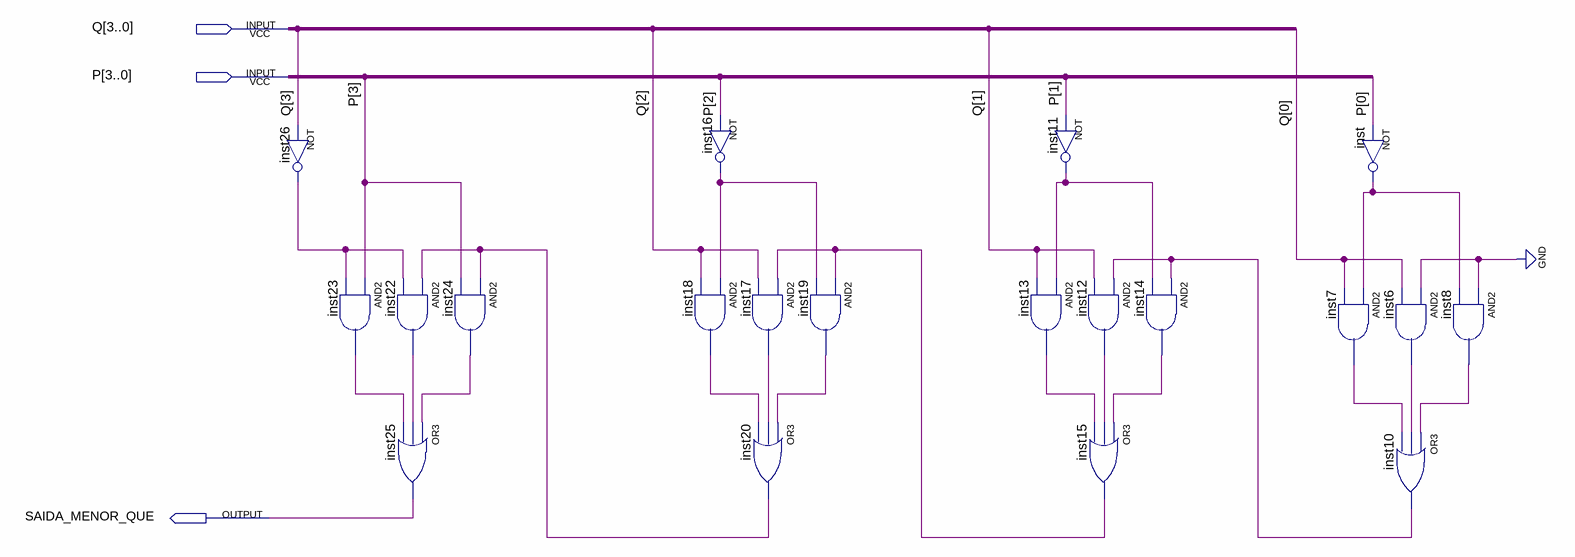
[diagram p0: schematic sheet]
// Quartus schematic MENOR_QUE4bt.bdf as structural Verilog: 20 symbols, 3 pins
module MENOR_QUE4bt (
  input  [3:0] Q,
  input  [3:0] P,
  output SAIDA_MENOR_QUE
);

  wire inst6_out, inst7_out, inst8_out, inst10_out, inst11_out, inst12_out, inst13_out, inst14_out,
       inst15_out, inst16_out, inst17_out, inst18_out, inst19_out, inst20_out, inst22_out, inst23_out,
       inst24_out, inst26_out, inst_out;

  not inst26 (inst26_out, Q[3]);
  and inst23 (inst23_out, P[3], inst26_out);
  and inst22 (inst22_out, inst20_out, inst26_out);
  and inst24 (inst24_out, inst20_out, P[3]);
  or inst25 (SAIDA_MENOR_QUE, inst24_out, inst22_out, inst23_out);
  and inst18 (inst18_out, inst16_out, Q[2]);
  not inst16 (inst16_out, P[2]);
  and inst17 (inst17_out, inst15_out, Q[2]);
  or inst20 (inst20_out, inst19_out, inst17_out, inst18_out);
  and inst19 (inst19_out, inst15_out, inst16_out);
  not inst11 (inst11_out, P[1]);
  and inst13 (inst13_out, inst11_out, Q[1]);
  and inst12 (inst12_out, inst10_out, Q[1]);
  and inst14 (inst14_out, inst10_out, inst11_out);
  or inst15 (inst15_out, inst14_out, inst12_out, inst13_out);
  not inst (inst_out, P[0]);
  and inst7 (inst7_out, inst_out, Q[0]);
  and inst6 (inst6_out, 1'b0, Q[0]);
  and inst8 (inst8_out, 1'b0, inst_out);
  or inst10 (inst10_out, inst8_out, inst6_out, inst7_out);
endmodule
